# Altium schematic sheet dislay.SchDoc
size A
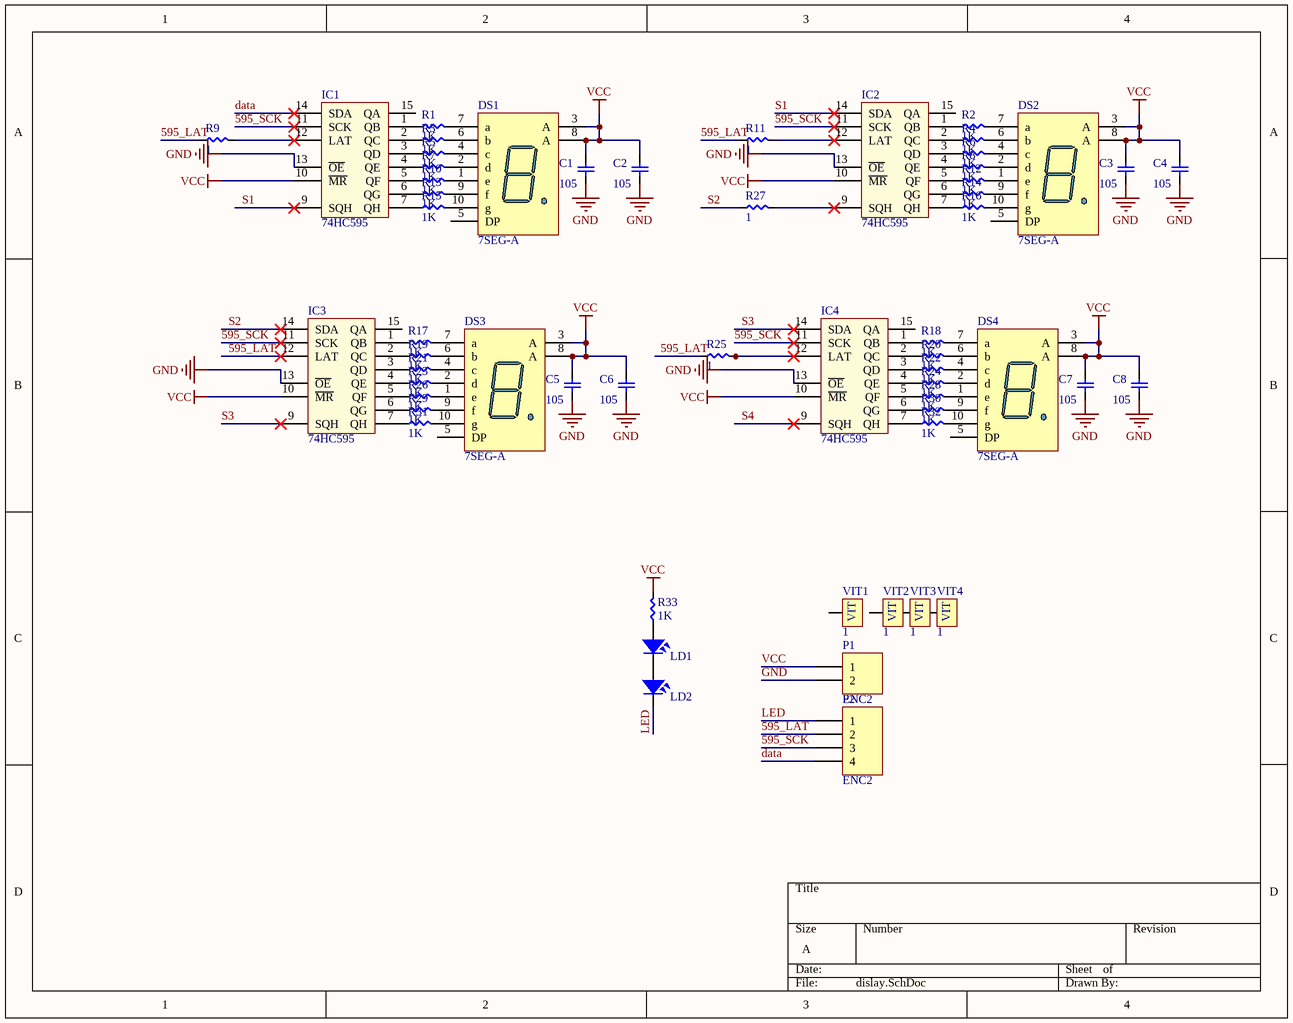
[diagram p0: dislay.SchDoc]

## Parts
C1  value 105  [SM-0805]  (hidden comment: Cap 1206 BUT)
C2  value 105  [SM-0805]  (hidden comment: Cap 1206 BUT)
C3  value 105  [SM-0805]  (hidden comment: Cap 1206 BUT)
C4  value 105  [SM-0805]  (hidden comment: Cap 1206 BUT)
C5  value 105  [SM-0805]  (hidden comment: Cap 1206 BUT)
C6  value 105  [SM-0805]  (hidden comment: Cap 1206 BUT)
C7  value 105  [SM-0805]  (hidden comment: Cap 1206 BUT)
C8  value 105  [SM-0805]  (hidden comment: Cap 1206 BUT)
DS1  7SEG-A  [7SEG_20X38]
DS2  7SEG-A  [7SEG_20X38]
DS3  7SEG-A  [7SEG_20X38]
DS4  7SEG-A  [7SEG_20X38]
IC1  74HC595  [dip16]
IC2  74HC595  [diP16]
IC3  74HC595  [dip16]
IC4  74HC595  [dip16]
LD1  LED  [LED-5 GRe]  (value not drawn)
LD2  LED  [LED-5 GRe]  (value not drawn)
P1  ENC2  [con2]
P2  ENC2  [HDR1X4]
R1  1K  [RES 0805 BUT]
R2  1K  [RES 0805 BUT]
R3  1K  [RES 0805 BUT]
R4  1K  [RES 0805 BUT]
R5  1K  [RES 0805 BUT]
R6  1K  [RES 0805 BUT]
R7  1K  [RES 0805 BUT]
R8  1K  [RES 0805 BUT]
R9  1  [RES 0805 BUT]
R10  1K  [RES 0805 BUT]
R11  1  [RES 0805 BUT]
R12  1K  [RES 0805 BUT]
R13  1K  [RES 0805 BUT]
R14  1K  [RES 0805 BUT]
R15  1K  [RES 0805 BUT]
R16  1K  [RES 0805 BUT]
R17  1K  [RES 0805 BUT]
R18  1K  [RES 0805 BUT]
R19  1K  [RES 0805 BUT]
R20  1K  [RES 0805 BUT]
R21  1K  [RES 0805 BUT]
R22  1K  [RES 0805 BUT]
R23  1K  [RES 0805 BUT]
R24  1K  [RES 0805 BUT]
R25  1  [RES 0805 BUT]
R26  1K  [RES 0805 BUT]
R27  1  [RES 0805 BUT]
R28  1K  [RES 0805 BUT]
R29  1K  [RES 0805 BUT]
R30  1K  [RES 0805 BUT]
R31  1K  [RES 0805 BUT]
R32  1K  [RES 0805 BUT]
R33  1K  [RES 0805 BUT]
VIT1  1  [VIT]
VIT2  1  [VIT]
VIT3  1  [VIT]
VIT4  1  [VIT]

## Nets
GND: C1.2 C2.2 C3.2 C4.2 C5.2 C6.2 C7.2 C8.2 IC1.8(GND) IC1.13(~{OE}) IC2.8(GND) IC2.13(~{OE}) IC3.8(GND) IC3.13(~{OE}) IC4.8(GND) IC4.13(~{OE}) P1.2
VCC: C1.1 C2.1 C3.1 C4.1 C5.1 C6.1 C7.1 C8.1 DS1.3(A) DS1.8(A) DS2.3(A) DS2.8(A) DS3.3(A) DS3.8(A) DS4.3(A) DS4.8(A) IC1.10(~{MR}) IC1.16(VCC) IC2.10(~{MR}) IC2.16(VCC) IC3.10(~{MR}) IC3.16(VCC) IC4.10(~{MR}) IC4.16(VCC) P1.1 R33.1
595_LAT: IC3.12(LAT) P2.2 R9.2 R11.2 R25.2
595_SCK: IC1.11(SCK) IC2.11(SCK) IC3.11(SCK) IC4.11(SCK) P2.3
data: IC1.14(SDA) P2.4
LED: LD2.2 P2.1
S1: IC1.9(SQH) IC2.14(SDA)
S2: IC3.14(SDA) R27.2
S3: IC3.9(SQH) IC4.14(SDA)
S4: IC4.9(SQH)
NetDS1_1: DS1.1(e) R10.1
NetDS1_2: DS1.2(d) R7.1
NetDS1_4: DS1.4(c) R5.1
NetDS1_6: DS1.6(b) R3.1
NetDS1_7: DS1.7(a) R1.1
NetDS1_9: DS1.9(f) R13.1
NetDS1_10: DS1.10(g) R15.1
NetDS2_1: DS2.1(e) R12.1
NetDS2_2: DS2.2(d) R8.1
NetDS2_4: DS2.4(c) R6.1
NetDS2_6: DS2.6(b) R4.1
NetDS2_7: DS2.7(a) R2.1
NetDS2_9: DS2.9(f) R14.1
NetDS2_10: DS2.10(g) R16.1
NetDS3_1: DS3.1(e) R26.1
NetDS3_2: DS3.2(d) R23.1
NetDS3_4: DS3.4(c) R21.1
NetDS3_6: DS3.6(b) R19.1
NetDS3_7: DS3.7(a) R17.1
NetDS3_9: DS3.9(f) R29.1
NetDS3_10: DS3.10(g) R31.1
NetDS4_1: DS4.1(e) R28.1
NetDS4_2: DS4.2(d) R24.1
NetDS4_4: DS4.4(c) R22.1
NetDS4_6: DS4.6(b) R20.1
NetDS4_7: DS4.7(a) R18.1
NetDS4_9: DS4.9(f) R30.1
NetDS4_10: DS4.10(g) R32.1
NetIC1_1: IC1.1(QB) R1.2
NetIC1_2: IC1.2(QC) R3.2
NetIC1_3: IC1.3(QD) R5.2
NetIC1_4: IC1.4(QE) R7.2
NetIC1_5: IC1.5(QF) R10.2
NetIC1_6: IC1.6(QG) R13.2
NetIC1_7: IC1.7(QH) R15.2
NetIC1_12: IC1.12(LAT) R9.1
NetIC2_1: IC2.1(QB) R2.2
NetIC2_2: IC2.2(QC) R4.2
NetIC2_3: IC2.3(QD) R6.2
NetIC2_4: IC2.4(QE) R8.2
NetIC2_5: IC2.5(QF) R12.2
NetIC2_6: IC2.6(QG) R14.2
NetIC2_7: IC2.7(QH) R16.2
NetIC2_9: IC2.9(SQH) R27.1
NetIC2_12: IC2.12(LAT) R11.1
NetIC3_1: IC3.1(QB) R17.2
NetIC3_2: IC3.2(QC) R19.2
NetIC3_3: IC3.3(QD) R21.2
NetIC3_4: IC3.4(QE) R23.2
NetIC3_5: IC3.5(QF) R26.2
NetIC3_6: IC3.6(QG) R29.2
NetIC3_7: IC3.7(QH) R31.2
NetIC4_1: IC4.1(QB) R18.2
NetIC4_2: IC4.2(QC) R20.2
NetIC4_3: IC4.3(QD) R22.2
NetIC4_4: IC4.4(QE) R24.2
NetIC4_5: IC4.5(QF) R28.2
NetIC4_6: IC4.6(QG) R30.2
NetIC4_7: IC4.7(QH) R32.2
NetIC4_12: IC4.12(LAT) R25.1
NetLD1_1: LD1.1 R33.2
NetLD1_2: LD1.2 LD2.1

Not connected (* = marked no-connect by the designer): DS1 5(DP); DS2 5(DP); DS3 5(DP); DS4 5(DP); IC1 15(QA); IC2 15(QA); IC3 15(QA); IC4 15(QA); VIT1 VIT1(1); VIT2 VIT1(1); VIT3 VIT1(1); VIT4 VIT1(1)

## Library data of the parts
C1-C8 = Cap 1206 BUT: Capacitor; Published: 8-Jun-2000; LatestRevisionDate: 17-Jul-2002; LatestRevisionNote: Re-released for DXP Platform.; PackageReference: RAD-0.3; Publisher: Altium Limited
DS1-DS4 = LED7SEG-A: 14.2 mm General Purpose Blue 7-Segment Display: CA, RH DP, Gray Surface; MinimumIntensity: 2020 ucd; Note: IF = 10 mA; Published: 8-Jun-2000; LatestRevisionDate: 17-Dec-2003; LatestRevisionNote: Schematic revised, PCB Footprint replaced.; DatasheetDocument: 24-Sep-2002; PackageDocument: 24-Sep-2002; PackageReference: H; Publisher: Altium Limited; Colour: Blue; ComponentLink1Description: Manufacturer Link; ComponentLink1URL: http://www.agilent.com/
IC1-IC4 = 74595: 8 Bit Serial input - Parallel Output; Value: 74HC595
LD1 LD2 = LED: LED Single colour Green and Red; Value: LED 3 ly Single Colour; Description: LED 5 ly Single Colour; Description: Led  Vuong
P1 = Header 2: Header, 2-Pin; LatestRevisionDate: 17-Jul-2002; LatestRevisionNote: Re-released for DXP Platform.; Publisher: Altium Limited
P2 = Header 4: Header, 4-Pin; LatestRevisionDate: 17-Jul-2002; LatestRevisionNote: Re-released for DXP Platform.; Publisher: Altium Limited
R1-R33 = RES 1206 BUT: Resistor
VIT1-VIT4 = VIT: Oc Vit